# Altium schematic sheet bmsSlave_main.SchDoc
size C; SheetNumber: 2; SheetTotal: 2
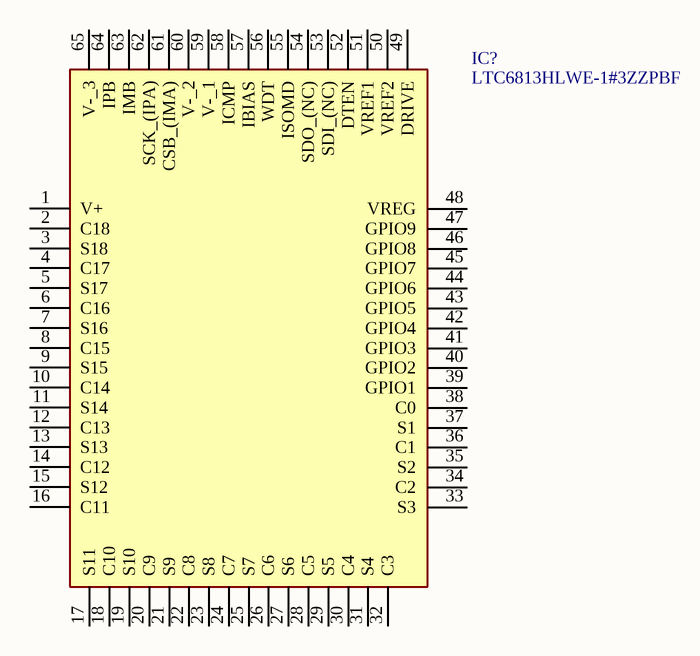
[diagram p0: bmsSlave_main.SchDoc]

## Parts
IC?  LTC6813HLWE-1#3ZZPBF  [QFP50P1200X1200X160-65N]

## Nets

Not connected (* = marked no-connect by the designer): IC? 1(V+) 2(C18) 3(S18) 4(C17) 5(S17) 6(C16) 7(S16) 8(C15) 9(S15) 10(C14) 11(S14) 12(C13) 13(S13) 14(C12) 15(S12) 16(C11) 17(S11) 18(C10) 19(S10) 20(C9) 21(S9) 22(C8) 23(S8) 24(C7) 25(S7) 26(C6) 27(S6) 28(C5) 29(S5) 30(C4) 31(S4) 32(C3) 33(S3) 34(C2) 35(S2) 36(C1) 37(S1) 38(C0) 39(GPIO1) 40(GPIO2) 41(GPIO3) 42(GPIO4) 43(GPIO5) 44(GPIO6) 45(GPIO7) 46(GPIO8) 47(GPIO9) 48(VREG) 49(DRIVE) 50(VREF2) 51(VREF1) 52(DTEN) 53(SDI_(NC)) 54(SDO_(NC)) 55(ISOMD) 56(WDT) 57(IBIAS) 58(ICMP) 59(V-_1) 60(V-_2) 61(CSB_(IMA)) 62(SCK_(IPA)) 63(IMB) 64(IPB) 65(V-_3)

## Library data of the parts
IC? = LTC6813HLWE-1#3ZZPBF: Integrated Circuit; Manufacturer_Name: Analog Devices; Datasheet Link: https://www.analog.com/media/en/technical-documentation/data-sheets/LTC6813-1.pdf; Height: 1.6mm; Manufacturer_Part_Number: LTC6813HLWE-1#3ZZPBF; Mouser Part Number: 584-6813HLWE13ZZPBF; Mouser Price/Stock: https://www.mouser.co.uk/ProductDetail/Analog-Devices-Linear-Technology/LTC6813HLWE-13ZZPBF?qs=lYGu3FyN48e3Qu9IYnRGuQ%3D%3D; Arrow Part Number: LTC6813HLWE-1#3ZZPBF; Arrow Price/Stock: https://www.arrow.com/en/products/ltc6813hlwe-13zzpbf/linear-technology